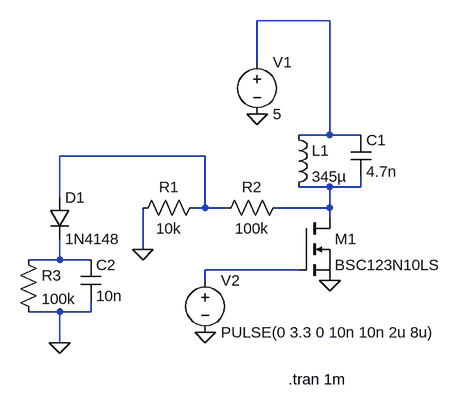
[diagram p0: schematic passiveFOBTransceiver.asc]
passiveFOBTransceiver.asc, the LTspice schematic file:
Version 4
SHEET 1 924 728
WIRE 432 160 320 160
WIRE 320 224 320 160
WIRE 432 336 432 160
WIRE 432 336 384 336
WIRE 480 336 432 336
WIRE 240 368 16 368
WIRE 432 416 384 416
WIRE 480 416 480 400
WIRE 480 416 432 416
WIRE 16 432 16 368
WIRE 240 448 240 368
WIRE 240 448 224 448
WIRE 272 448 240 448
WIRE 432 448 432 416
WIRE 432 448 352 448
WIRE 432 464 432 448
WIRE 144 512 144 448
WIRE 16 528 16 496
WIRE 16 528 -32 528
WIRE 64 528 16 528
WIRE 384 544 240 544
WIRE 240 560 240 544
WIRE 16 608 -32 608
WIRE 64 608 64 592
WIRE 64 608 16 608
WIRE 16 656 16 608
FLAG 320 304 0
FLAG 240 640 0
FLAG 432 560 0
FLAG 16 656 0
FLAG 144 512 0
SYMBOL Voltage 320 208 R0
SYMATTR InstName V1
SYMATTR Value 5
SYMBOL Voltage 240 544 R0
SYMATTR InstName V2
SYMATTR Value PULSE(0 3.3 0 10n 10n 2u 8u)
SYMBOL nmos 384 464 R0
SYMATTR InstName M1
SYMATTR Value BSC123N10LS
SYMBOL ind 368 320 R0
SYMATTR InstName L1
SYMATTR Value 345µ
SYMBOL Cap 464 336 R0
SYMATTR InstName C1
SYMATTR Value 4.7n
SYMBOL Res 240 432 R90
WINDOW 0 0 56 VBottom 2
WINDOW 3 32 56 VTop 2
SYMATTR InstName R1
SYMATTR Value 10k
SYMBOL Res 368 432 R90
WINDOW 0 0 56 VBottom 2
WINDOW 3 32 56 VTop 2
SYMATTR InstName R2
SYMATTR Value 100k
SYMBOL diode 0 432 R0
SYMATTR InstName D1
SYMATTR Value 1N4148
SYMBOL Res -48 512 R0
SYMATTR InstName R3
SYMATTR Value 100k
SYMBOL Cap 48 528 R0
SYMATTR InstName C2
SYMATTR Value 10n
TEXT 368 712 Left 2 !.tran 1m

The netlist it stands for:
* passiveFOBTransceiver.asc
V1 N001 0 5
V2 N005 0 PULSE(0 3.3 0 10n 10n 2u 8u)
M1 N003 N005 0 0 BSC123N10LS
L1 N001 N003 345µ
C1 N001 N003 4.7n
R1 N002 0 10k
R2 N003 N002 100k
D1 N002 N004 1N4148
R3 N004 0 100k
C2 N004 0 10n
.model D D
.lib standard.dio
.model NMOS NMOS
.model PMOS PMOS
.lib standard.mos
.tran 1m
.backanno
.end